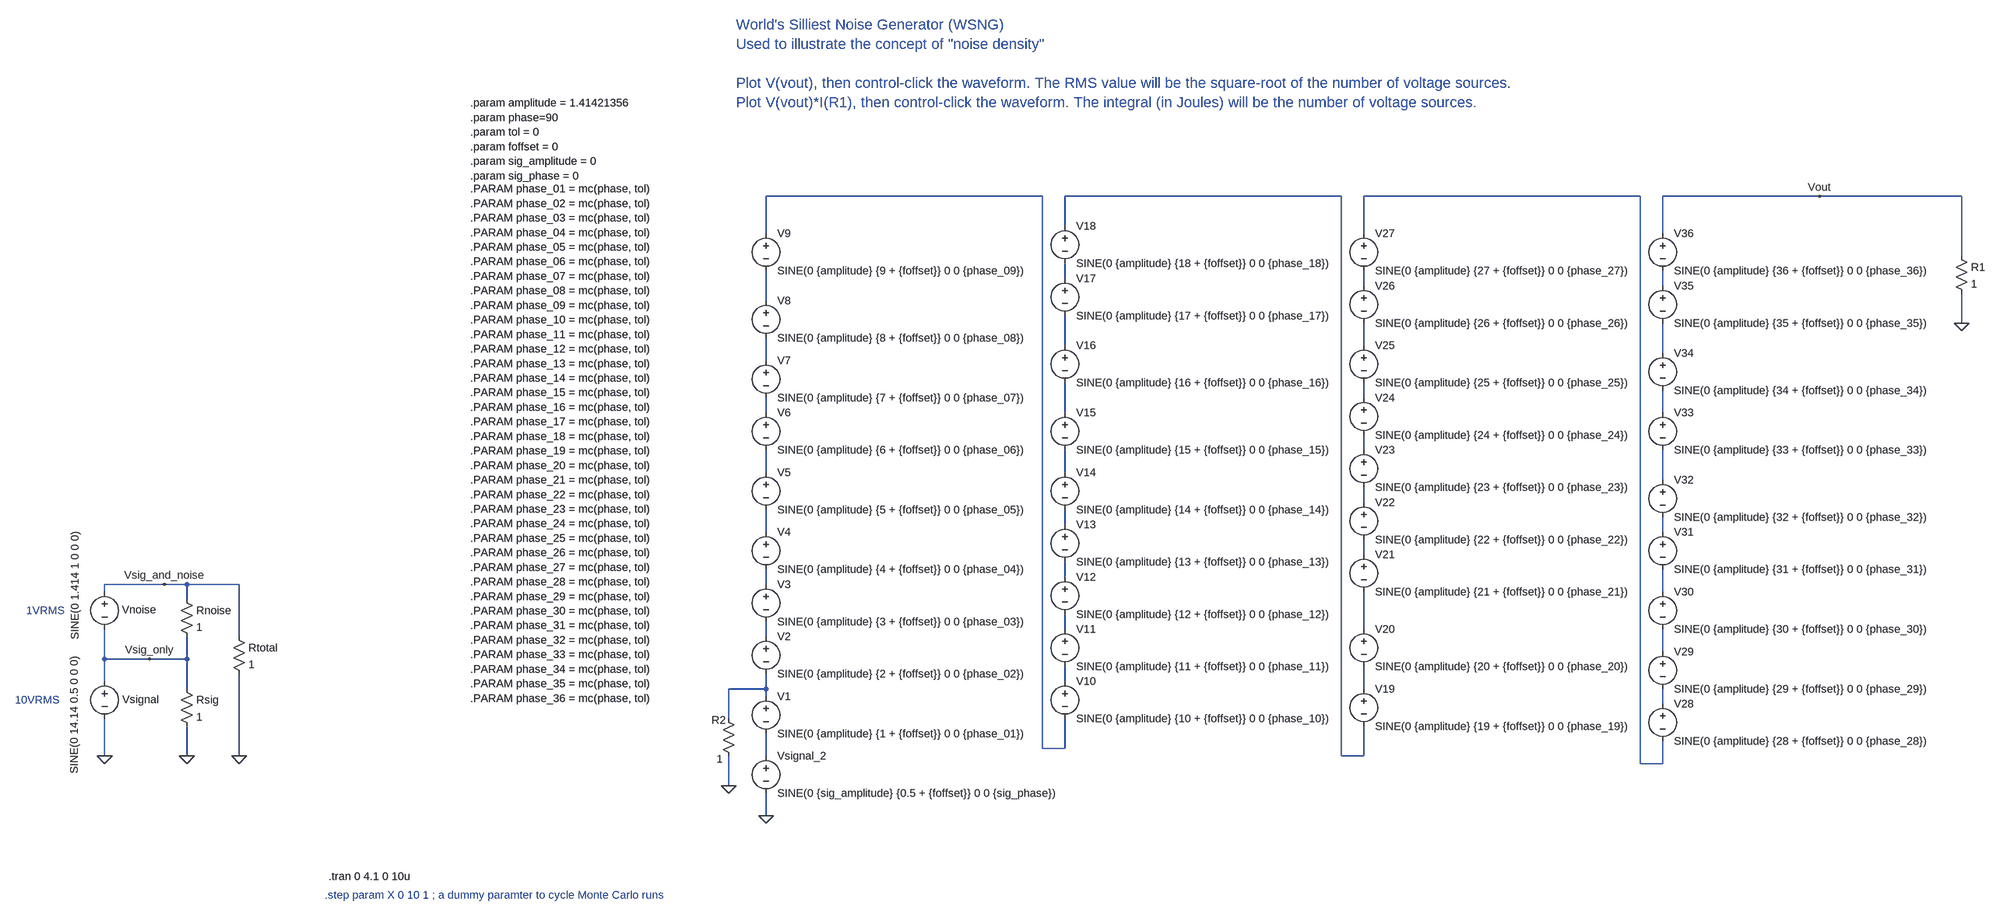
[diagram p0: schematic WSNG.asc]
WSNG.asc, the LTspice schematic file:
Version 4
SHEET 1 3704 740
WIRE -48 -976 -640 -976
WIRE 592 -976 0 -976
WIRE 1232 -976 640 -976
WIRE 1616 -976 1280 -976
WIRE 1920 -976 1616 -976
WIRE 0 -912 0 -976
WIRE -640 -896 -640 -976
WIRE 640 -896 640 -976
WIRE 1280 -896 1280 -976
WIRE 1920 -848 1920 -976
WIRE 0 -800 0 -832
WIRE 640 -784 640 -816
WIRE 1280 -784 1280 -816
WIRE -640 -752 -640 -816
WIRE 1920 -704 1920 -768
WIRE 0 -656 0 -720
WIRE 640 -656 640 -704
WIRE 1280 -640 1280 -704
WIRE -640 -624 -640 -672
WIRE 640 -544 640 -576
WIRE -640 -512 -640 -544
WIRE 0 -512 0 -576
WIRE 1280 -512 1280 -560
WIRE 640 -432 640 -464
WIRE -640 -384 -640 -432
WIRE 0 -384 0 -432
WIRE 1280 -368 1280 -432
WIRE 640 -320 640 -352
WIRE 0 -272 0 -304
WIRE -640 -256 -640 -304
WIRE 1280 -256 1280 -288
WIRE 640 -208 640 -240
WIRE 0 -160 0 -192
WIRE -2400 -144 -2528 -144
WIRE -2352 -144 -2400 -144
WIRE -2240 -144 -2352 -144
WIRE -640 -144 -640 -176
WIRE -2528 -128 -2528 -144
WIRE 1280 -128 1280 -176
WIRE -2352 -112 -2352 -144
WIRE 0 -48 0 -80
WIRE 640 -48 640 -128
WIRE -2240 -32 -2240 -144
WIRE -640 -32 -640 -64
WIRE 1280 0 1280 -48
WIRE -2528 16 -2528 -48
WIRE -2432 16 -2528 16
WIRE -2352 16 -2352 -32
WIRE -2352 16 -2432 16
WIRE -2528 64 -2528 16
WIRE 0 64 0 32
WIRE -2352 80 -2352 16
WIRE -640 80 -640 48
WIRE -640 80 -720 80
WIRE 640 80 640 32
WIRE -640 96 -640 80
WIRE 1280 112 1280 80
WIRE -720 144 -720 80
WIRE -48 208 -48 -976
WIRE 0 208 0 144
WIRE 0 208 -48 208
WIRE -2528 224 -2528 144
WIRE -2352 224 -2352 160
WIRE -2240 224 -2240 48
WIRE -640 224 -640 176
WIRE 592 224 592 -976
WIRE 640 224 640 160
WIRE 640 224 592 224
WIRE 1232 240 1232 -976
WIRE 1280 240 1280 192
WIRE 1280 240 1232 240
WIRE -720 288 -720 224
WIRE -640 352 -640 304
FLAG -640 352 0
FLAG 1920 -704 0
FLAG -720 288 0
FLAG 1616 -976 Vout
FLAG -2528 224 0
FLAG -2240 224 0
FLAG -2400 -144 Vsig_and_noise
FLAG -2352 224 0
FLAG -2432 16 Vsig_only
SYMBOL voltage -640 80 R0
WINDOW 123 0 0 Left 2
WINDOW 39 0 0 Left 2
SYMATTR InstName V1
SYMATTR Value SINE(0 {amplitude} {1 + {foffset}} 0 0 {phase_01})
SYMBOL voltage -640 -48 R0
WINDOW 123 0 0 Left 2
WINDOW 39 0 0 Left 2
SYMATTR InstName V2
SYMATTR Value SINE(0 {amplitude} {2 + {foffset}} 0 0 {phase_02})
SYMBOL voltage -640 -160 R0
WINDOW 123 0 0 Left 2
WINDOW 39 0 0 Left 2
SYMATTR InstName V3
SYMATTR Value SINE(0 {amplitude} {3 + {foffset}} 0 0 {phase_03})
SYMBOL voltage -640 -272 R0
WINDOW 123 0 0 Left 2
WINDOW 39 0 0 Left 2
SYMATTR InstName V4
SYMATTR Value SINE(0 {amplitude} {4 + {foffset}} 0 0 {phase_04})
SYMBOL voltage -640 -400 R0
WINDOW 123 0 0 Left 2
WINDOW 39 0 0 Left 2
SYMATTR InstName V5
SYMATTR Value SINE(0 {amplitude} {5 + {foffset}} 0 0 {phase_05})
SYMBOL res 1904 -864 R0
SYMATTR InstName R1
SYMATTR Value 1
SYMBOL voltage -640 -528 R0
WINDOW 123 0 0 Left 2
WINDOW 39 0 0 Left 2
SYMATTR InstName V6
SYMATTR Value SINE(0 {amplitude} {6 + {foffset}} 0 0 {phase_06})
SYMBOL voltage -640 -640 R0
WINDOW 123 0 0 Left 2
WINDOW 39 0 0 Left 2
SYMATTR InstName V7
SYMATTR Value SINE(0 {amplitude} {7 + {foffset}} 0 0 {phase_07})
SYMBOL voltage -640 -768 R0
WINDOW 123 0 0 Left 2
WINDOW 39 0 0 Left 2
SYMATTR InstName V8
SYMATTR Value SINE(0 {amplitude} {8 + {foffset}} 0 0 {phase_08})
SYMBOL voltage -640 -912 R0
WINDOW 123 0 0 Left 2
WINDOW 39 0 0 Left 2
SYMATTR InstName V9
SYMATTR Value SINE(0 {amplitude} {9 + {foffset}} 0 0 {phase_09})
SYMBOL voltage 0 48 R0
WINDOW 123 0 0 Left 2
WINDOW 39 0 0 Left 2
SYMATTR InstName V10
SYMATTR Value SINE(0 {amplitude} {10 + {foffset}} 0 0 {phase_10})
SYMBOL voltage 0 -64 R0
WINDOW 123 0 0 Left 2
WINDOW 39 0 0 Left 2
SYMATTR InstName V11
SYMATTR Value SINE(0 {amplitude} {11 + {foffset}} 0 0 {phase_11})
SYMBOL voltage 0 -176 R0
WINDOW 123 0 0 Left 2
WINDOW 39 0 0 Left 2
SYMATTR InstName V12
SYMATTR Value SINE(0 {amplitude} {12 + {foffset}} 0 0 {phase_12})
SYMBOL voltage 0 -288 R0
WINDOW 123 0 0 Left 2
WINDOW 39 0 0 Left 2
SYMATTR InstName V13
SYMATTR Value SINE(0 {amplitude} {13 + {foffset}} 0 0 {phase_13})
SYMBOL voltage 0 -400 R0
WINDOW 123 0 0 Left 2
WINDOW 39 0 0 Left 2
SYMATTR InstName V14
SYMATTR Value SINE(0 {amplitude} {14 + {foffset}} 0 0 {phase_14})
SYMBOL voltage 0 -528 R0
WINDOW 123 0 0 Left 2
WINDOW 39 0 0 Left 2
SYMATTR InstName V15
SYMATTR Value SINE(0 {amplitude} {15 + {foffset}} 0 0 {phase_15})
SYMBOL voltage 0 -672 R0
WINDOW 123 0 0 Left 2
WINDOW 39 0 0 Left 2
SYMATTR InstName V16
SYMATTR Value SINE(0 {amplitude} {16 + {foffset}} 0 0 {phase_16})
SYMBOL voltage 0 -816 R0
WINDOW 123 0 0 Left 2
WINDOW 39 0 0 Left 2
SYMATTR InstName V17
SYMATTR Value SINE(0 {amplitude} {17 + {foffset}} 0 0 {phase_17})
SYMBOL voltage 0 -928 R0
WINDOW 123 0 0 Left 2
WINDOW 39 0 0 Left 2
SYMATTR InstName V18
SYMATTR Value SINE(0 {amplitude} {18 + {foffset}} 0 0 {phase_18})
SYMBOL voltage 640 64 R0
WINDOW 123 0 0 Left 2
WINDOW 39 0 0 Left 2
SYMATTR InstName V19
SYMATTR Value SINE(0 {amplitude} {19 + {foffset}} 0 0 {phase_19})
SYMBOL voltage 640 -64 R0
WINDOW 123 0 0 Left 2
WINDOW 39 0 0 Left 2
SYMATTR InstName V20
SYMATTR Value SINE(0 {amplitude} {20 + {foffset}} 0 0 {phase_20})
SYMBOL voltage 640 -224 R0
WINDOW 123 0 0 Left 2
WINDOW 39 0 0 Left 2
SYMATTR InstName V21
SYMATTR Value SINE(0 {amplitude} {21 + {foffset}} 0 0 {phase_21})
SYMBOL voltage 640 -336 R0
WINDOW 123 0 0 Left 2
WINDOW 39 0 0 Left 2
SYMATTR InstName V22
SYMATTR Value SINE(0 {amplitude} {22 + {foffset}} 0 0 {phase_22})
SYMBOL voltage 640 -448 R0
WINDOW 123 0 0 Left 2
WINDOW 39 0 0 Left 2
SYMATTR InstName V23
SYMATTR Value SINE(0 {amplitude} {23 + {foffset}} 0 0 {phase_23})
SYMBOL voltage 640 -560 R0
WINDOW 123 0 0 Left 2
WINDOW 39 0 0 Left 2
SYMATTR InstName V24
SYMATTR Value SINE(0 {amplitude} {24 + {foffset}} 0 0 {phase_24})
SYMBOL voltage 640 -672 R0
WINDOW 123 0 0 Left 2
WINDOW 39 0 0 Left 2
SYMATTR InstName V25
SYMATTR Value SINE(0 {amplitude} {25 + {foffset}} 0 0 {phase_25})
SYMBOL res -736 128 R0
WINDOW 0 -21 19 Left 2
WINDOW 3 -10 102 Left 2
SYMATTR InstName R2
SYMATTR Value 1
SYMBOL voltage 640 -800 R0
WINDOW 123 0 0 Left 2
WINDOW 39 0 0 Left 2
SYMATTR InstName V26
SYMATTR Value SINE(0 {amplitude} {26 + {foffset}} 0 0 {phase_26})
SYMBOL voltage 640 -912 R0
WINDOW 123 0 0 Left 2
WINDOW 39 0 0 Left 2
SYMATTR InstName V27
SYMATTR Value SINE(0 {amplitude} {27 + {foffset}} 0 0 {phase_27})
SYMBOL voltage 1280 96 R0
WINDOW 123 0 0 Left 2
WINDOW 39 0 0 Left 2
SYMATTR InstName V28
SYMATTR Value SINE(0 {amplitude} {28 + {foffset}} 0 0 {phase_28})
SYMBOL voltage 1280 -16 R0
WINDOW 123 0 0 Left 2
WINDOW 39 0 0 Left 2
SYMATTR InstName V29
SYMATTR Value SINE(0 {amplitude} {29 + {foffset}} 0 0 {phase_29})
SYMBOL voltage 1280 -144 R0
WINDOW 123 0 0 Left 2
WINDOW 39 0 0 Left 2
SYMATTR InstName V30
SYMATTR Value SINE(0 {amplitude} {30 + {foffset}} 0 0 {phase_30})
SYMBOL voltage 1280 -272 R0
WINDOW 123 0 0 Left 2
WINDOW 39 0 0 Left 2
SYMATTR InstName V31
SYMATTR Value SINE(0 {amplitude} {31 + {foffset}} 0 0 {phase_31})
SYMBOL voltage 1280 -384 R0
WINDOW 123 0 0 Left 2
WINDOW 39 0 0 Left 2
SYMATTR InstName V32
SYMATTR Value SINE(0 {amplitude} {32 + {foffset}} 0 0 {phase_32})
SYMBOL voltage 1280 -528 R0
WINDOW 123 0 0 Left 2
WINDOW 39 0 0 Left 2
SYMATTR InstName V33
SYMATTR Value SINE(0 {amplitude} {33 + {foffset}} 0 0 {phase_33})
SYMBOL voltage 1280 -656 R0
WINDOW 123 0 0 Left 2
WINDOW 39 0 0 Left 2
SYMATTR InstName V34
SYMATTR Value SINE(0 {amplitude} {34 + {foffset}} 0 0 {phase_34})
SYMBOL voltage 1280 -800 R0
WINDOW 123 0 0 Left 2
WINDOW 39 0 0 Left 2
SYMATTR InstName V35
SYMATTR Value SINE(0 {amplitude} {35 + {foffset}} 0 0 {phase_35})
SYMBOL voltage 1280 -912 R0
WINDOW 123 0 0 Left 2
WINDOW 39 0 0 Left 2
SYMATTR InstName V36
SYMATTR Value SINE(0 {amplitude} {36 + {foffset}} 0 0 {phase_36})
SYMBOL voltage -640 208 R0
WINDOW 123 0 0 Left 2
WINDOW 39 0 0 Left 2
SYMATTR InstName Vsignal_2
SYMATTR Value SINE(0 {sig_amplitude} {0.5 + {foffset}} 0 0 {sig_phase})
SYMBOL voltage -2528 -144 R0
WINDOW 123 0 0 Left 2
WINDOW 39 0 0 Left 2
WINDOW 0 37 54 Left 2
WINDOW 3 -63 -115 VRight 2
SYMATTR InstName Vnoise
SYMATTR Value SINE(0 1.414 1 0 0 0)
SYMBOL res -2256 -48 R0
SYMATTR InstName Rtotal
SYMATTR Value 1
SYMBOL voltage -2528 48 R0
WINDOW 123 0 0 Left 2
WINDOW 39 0 0 Left 2
WINDOW 0 38 55 Left 2
WINDOW 3 -65 -40 VRight 2
SYMATTR InstName Vsignal
SYMATTR Value SINE(0 14.14 0.5 0 0 0)
SYMBOL res -2368 64 R0
SYMATTR InstName Rsig
SYMATTR Value 1
SYMBOL res -2368 -128 R0
SYMATTR InstName Rnoise
SYMATTR Value 1
TEXT -1672 592 Left 2 !.tran 0 4.1 0 10u
TEXT -704 -1344 Left 3 ;World's Silliest Noise Generator (WSNG)\nUsed to illustrate the concept of "noise density"\n \nPlot V(vout), then control-click the waveform. The RMS value will be the square-root of the number of voltage sources.\nPlot V(vout)*I(R1), then control-click the waveform. The integral (in Joules) will be the number of voltage sources.
TEXT -1368 -992 Left 2 !.PARAM phase_01 = mc(phase, tol)\n.PARAM phase_02 = mc(phase, tol)\n.PARAM phase_03 = mc(phase, tol)\n.PARAM phase_04 = mc(phase, tol)\n.PARAM phase_05 = mc(phase, tol)\n.PARAM phase_06 = mc(phase, tol)\n.PARAM phase_07 = mc(phase, tol)\n.PARAM phase_08 = mc(phase, tol)\n.PARAM phase_09 = mc(phase, tol)\n.PARAM phase_10 = mc(phase, tol)\n.PARAM phase_11 = mc(phase, tol)\n.PARAM phase_12 = mc(phase, tol)\n.PARAM phase_13 = mc(phase, tol)\n.PARAM phase_14 = mc(phase, tol)\n.PARAM phase_15 = mc(phase, tol)\n.PARAM phase_16 = mc(phase, tol)\n.PARAM phase_17 = mc(phase, tol)\n.PARAM phase_18 = mc(phase, tol)\n.PARAM phase_19 = mc(phase, tol)\n.PARAM phase_20 = mc(phase, tol)\n.PARAM phase_21 = mc(phase, tol)\n.PARAM phase_22 = mc(phase, tol)\n.PARAM phase_23 = mc(phase, tol)\n.PARAM phase_24 = mc(phase, tol)\n.PARAM phase_25 = mc(phase, tol)\n.PARAM phase_26 = mc(phase, tol)\n.PARAM phase_27 = mc(phase, tol)\n.PARAM phase_28 = mc(phase, tol)\n.PARAM phase_29 = mc(phase, tol)\n.PARAM phase_30 = mc(phase, tol)\n.PARAM phase_31 = mc(phase, tol)\n.PARAM phase_32 = mc(phase, tol)\n.PARAM phase_33 = mc(phase, tol)\n.PARAM phase_34 = mc(phase, tol)\n.PARAM phase_35 = mc(phase, tol)\n.PARAM phase_36 = mc(phase, tol)
TEXT -1680 632 Left 2 ;.step param X 0 10 1 ; a dummy paramter to cycle Monte Carlo runs
TEXT -1368 -1176 Left 2 !.param amplitude = 1.41421356\n.param phase=90\n.param tol = 0\n.param foffset = 0\n.param sig_amplitude = 0\n.param sig_phase = 0
TEXT -2720 104 Left 2 ;10VRMS
TEXT -2696 -88 Left 2 ;1VRMS

The netlist it stands for:
* WSNG.asc
V1 N033 N036 SINE(0 {amplitude} {1 + {foffset}} 0 0 {phase_01})
V2 N030 N033 SINE(0 {amplitude} {2 + {foffset}} 0 0 {phase_02})
V3 N026 N030 SINE(0 {amplitude} {3 + {foffset}} 0 0 {phase_03})
V4 N022 N026 SINE(0 {amplitude} {4 + {foffset}} 0 0 {phase_04})
V5 N017 N022 SINE(0 {amplitude} {5 + {foffset}} 0 0 {phase_05})
R1 Vout 0 1
V6 N013 N017 SINE(0 {amplitude} {6 + {foffset}} 0 0 {phase_06})
V7 N011 N013 SINE(0 {amplitude} {7 + {foffset}} 0 0 {phase_07})
V8 N007 N011 SINE(0 {amplitude} {8 + {foffset}} 0 0 {phase_08})
V9 N001 N007 SINE(0 {amplitude} {9 + {foffset}} 0 0 {phase_09})
V10 N032 N001 SINE(0 {amplitude} {10 + {foffset}} 0 0 {phase_10})
V11 N028 N032 SINE(0 {amplitude} {11 + {foffset}} 0 0 {phase_11})
V12 N025 N028 SINE(0 {amplitude} {12 + {foffset}} 0 0 {phase_12})
V13 N021 N025 SINE(0 {amplitude} {13 + {foffset}} 0 0 {phase_13})
V14 N018 N021 SINE(0 {amplitude} {14 + {foffset}} 0 0 {phase_14})
V15 N014 N018 SINE(0 {amplitude} {15 + {foffset}} 0 0 {phase_15})
V16 N008 N014 SINE(0 {amplitude} {16 + {foffset}} 0 0 {phase_16})
V17 N004 N008 SINE(0 {amplitude} {17 + {foffset}} 0 0 {phase_17})
V18 N002 N004 SINE(0 {amplitude} {18 + {foffset}} 0 0 {phase_18})
V19 N034 N002 SINE(0 {amplitude} {19 + {foffset}} 0 0 {phase_19})
V20 N029 N034 SINE(0 {amplitude} {20 + {foffset}} 0 0 {phase_20})
V21 N024 N029 SINE(0 {amplitude} {21 + {foffset}} 0 0 {phase_21})
V22 N020 N024 SINE(0 {amplitude} {22 + {foffset}} 0 0 {phase_22})
V23 N016 N020 SINE(0 {amplitude} {23 + {foffset}} 0 0 {phase_23})
V24 N012 N016 SINE(0 {amplitude} {24 + {foffset}} 0 0 {phase_24})
V25 N009 N012 SINE(0 {amplitude} {25 + {foffset}} 0 0 {phase_25})
R2 N033 0 1
V26 N005 N009 SINE(0 {amplitude} {26 + {foffset}} 0 0 {phase_26})
V27 N003 N005 SINE(0 {amplitude} {27 + {foffset}} 0 0 {phase_27})
V28 N035 N003 SINE(0 {amplitude} {28 + {foffset}} 0 0 {phase_28})
V29 N031 N035 SINE(0 {amplitude} {29 + {foffset}} 0 0 {phase_29})
V30 N027 N031 SINE(0 {amplitude} {30 + {foffset}} 0 0 {phase_30})
V31 N023 N027 SINE(0 {amplitude} {31 + {foffset}} 0 0 {phase_31})
V32 N019 N023 SINE(0 {amplitude} {32 + {foffset}} 0 0 {phase_32})
V33 N015 N019 SINE(0 {amplitude} {33 + {foffset}} 0 0 {phase_33})
V34 N010 N015 SINE(0 {amplitude} {34 + {foffset}} 0 0 {phase_34})
V35 N006 N010 SINE(0 {amplitude} {35 + {foffset}} 0 0 {phase_35})
V36 Vout N006 SINE(0 {amplitude} {36 + {foffset}} 0 0 {phase_36})
Vsignal_2 N036 0 SINE(0 {sig_amplitude} {0.5 + {foffset}} 0 0 {sig_phase})
Vnoise Vsig_and_noise Vsig_only SINE(0 1.414 1 0 0 0)
Rtotal Vsig_and_noise 0 1
Vsignal Vsig_only 0 SINE(0 14.14 0.5 0 0 0)
Rsig Vsig_only 0 1
Rnoise Vsig_and_noise Vsig_only 1
.tran 0 4.1 0 10u
* World's Silliest Noise Generator (WSNG)
* Used to illustrate the concept of "noise density"
* Plot V(vout), then control-click the waveform. The RMS value will be the square-root of the number of voltage sources.
* Plot V(vout)*I(R1), then control-click the waveform. The integral (in Joules) will be the number of voltage sources.
.PARAM phase_01 = mc(phase, tol)
.PARAM phase_02 = mc(phase, tol)
.PARAM phase_03 = mc(phase, tol)
.PARAM phase_04 = mc(phase, tol)
.PARAM phase_05 = mc(phase, tol)
.PARAM phase_06 = mc(phase, tol)
.PARAM phase_07 = mc(phase, tol)
.PARAM phase_08 = mc(phase, tol)
.PARAM phase_09 = mc(phase, tol)
.PARAM phase_10 = mc(phase, tol)
.PARAM phase_11 = mc(phase, tol)
.PARAM phase_12 = mc(phase, tol)
.PARAM phase_13 = mc(phase, tol)
.PARAM phase_14 = mc(phase, tol)
.PARAM phase_15 = mc(phase, tol)
.PARAM phase_16 = mc(phase, tol)
.PARAM phase_17 = mc(phase, tol)
.PARAM phase_18 = mc(phase, tol)
.PARAM phase_19 = mc(phase, tol)
.PARAM phase_20 = mc(phase, tol)
.PARAM phase_21 = mc(phase, tol)
.PARAM phase_22 = mc(phase, tol)
.PARAM phase_23 = mc(phase, tol)
.PARAM phase_24 = mc(phase, tol)
.PARAM phase_25 = mc(phase, tol)
.PARAM phase_26 = mc(phase, tol)
.PARAM phase_27 = mc(phase, tol)
.PARAM phase_28 = mc(phase, tol)
.PARAM phase_29 = mc(phase, tol)
.PARAM phase_30 = mc(phase, tol)
.PARAM phase_31 = mc(phase, tol)
.PARAM phase_32 = mc(phase, tol)
.PARAM phase_33 = mc(phase, tol)
.PARAM phase_34 = mc(phase, tol)
.PARAM phase_35 = mc(phase, tol)
.PARAM phase_36 = mc(phase, tol)
* .step param X 0 10 1 ; a dummy paramter to cycle Monte Carlo runs
.param amplitude = 1.41421356
.param phase=90
.param tol = 0
.param foffset = 0
.param sig_amplitude = 0
.param sig_phase = 0
* 10VRMS
* 1VRMS
.backanno
.end